# Altium schematic sheet Charging.SchDoc
size A
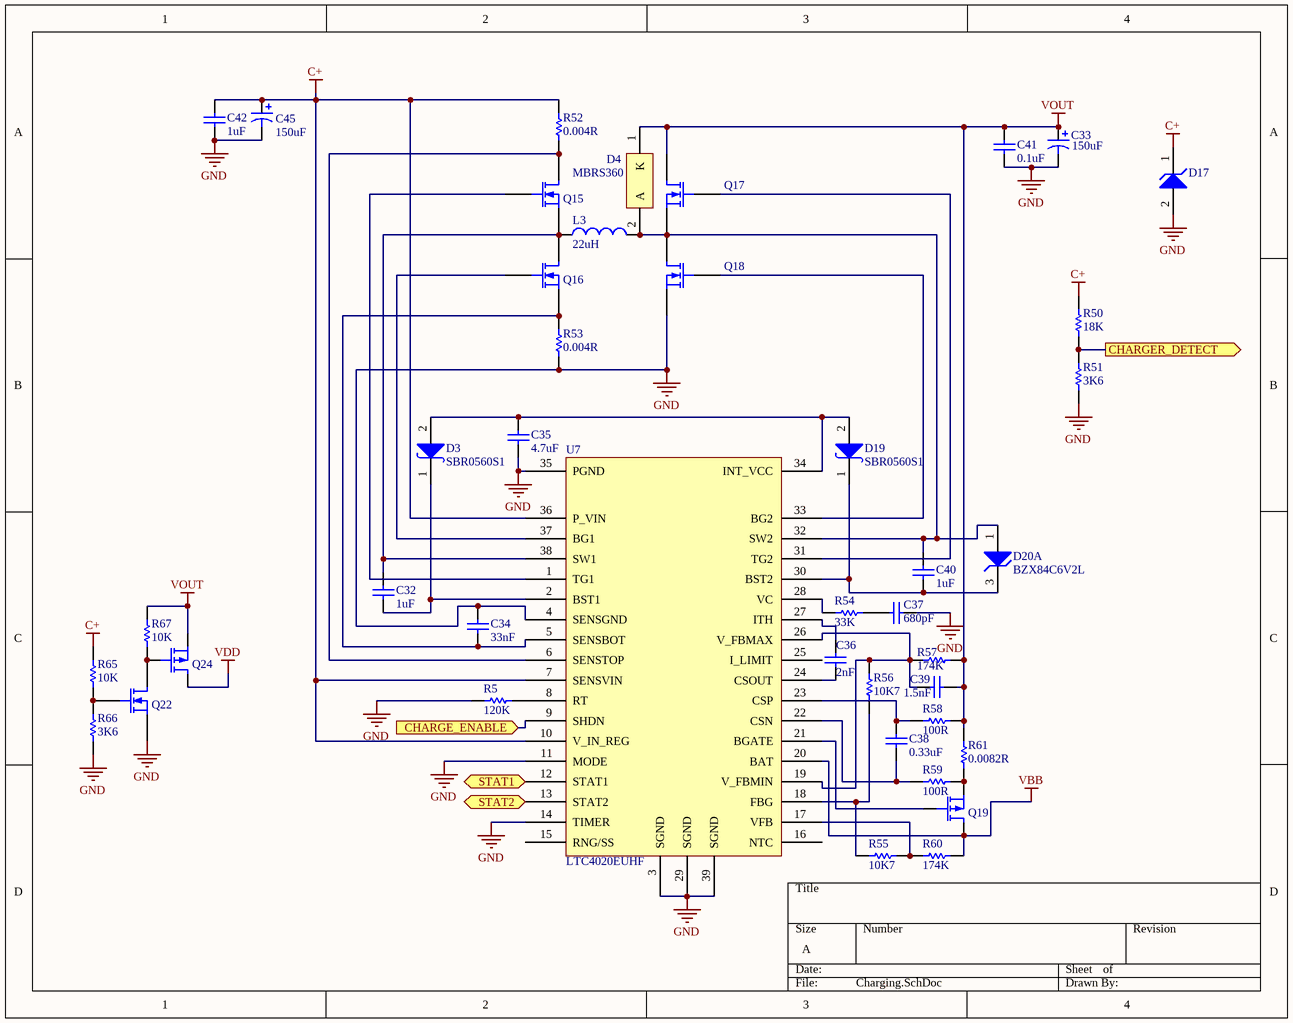
[diagram p0: Charging.SchDoc]

## Parts
C32  1uF  [CAPC0603(1608)100_L]
C33  value 150uF  [CAP 180uF 50V]
C34  33nF  [CAPC0603(1608)100_M]
C35  4.7uF  [CAPC0603(1608)55_L]
C36  2nF  [CAPC0603(1608)100_L]
C37  680pF  [CAPC0603(1608)100_L]
C38  0.33uF  [CAPC0603(1608)100_M]
C39  1.5nF  [CAPC0603(1608)100_N]
C40  1uF  [CAPC0603(1608)100_L]
C41  0.1uF  [CAPC0603(1608)100_L]
C42  1uF  [CAPC0603(1608)100_L]
C45  150uF  [CAP 150uF 25V]
D3  SBR0560S1  [SOD-123]
D4  MBRS360  [ONSC-SMB-2-403A-03_H_V]
D17  (no value)  [ONSC-SOD-123-2-425-04_V]
D19  SBR0560S1  [SOD-123]
D20  BZX84C6V2L  [ONSC-SOT-23-3-318-08_V]  (part A of 2)
L3  22uH  [IHLP-6767GZ]
Q15  MOSFET-N  [SOIC127P600X175-8N]  (value not drawn)
Q16  MOSFET-N  [SOIC127P600X175-8N]  (value not drawn)
Q17  MOSFET-N  [SOIC127P600X175-8N]  (value not drawn)
Q18  MOSFET-N  [SOIC127P600X175-8N]  (value not drawn)
Q19  MOSFET-P  [SOIC127P600X175-8N]  (value not drawn)
Q22  MOSFET-N  [SOT23-3]  (value not drawn)
Q24  MOSFET-P  [SOT23-3]  (value not drawn)
R5  120K  [RESC0603(1608)_L]
R50  18K  [RESC0603(1608)_L]
R51  3K6  [RESC0603(1608)_L]
R52  0.004R  [RESC1206(3216)_L]
R53  0.004R  [RESC1206(3216)_L]
R54  33K  [RESC0603(1608)_N]
R55  10K7  [RESC0603(1608)_M]
R56  10K7  [RESC0603(1608)_M]
R57  174K  [RESC0603(1608)_L]
R58  100R  [RESC0603(1608)_L]
R59  100R  [RESC0603(1608)_L]
R60  174K  [RESC0603(1608)_L]
R61  0.0082R  [RESC2010(5025)_M]
R65  10K  [RESC0603(1608)_N]
R66  3K6  [RESC0603(1608)_N]
R67  10K  [RESC0603(1608)_N]
U7  LTC4020EUHF  [QFN38]

## Ports
CHARGE_ENABLE (in), CHARGER_DETECT (out), STAT1 (out), STAT2 (out)

## Nets
C+: C42.2 C45.1 D17.1(K) R50.2 R52.2 R65.2 U7.7(SENSVIN) U7.10(V_IN_REG) U7.36(P_VIN)
GND: C33.2 C34.2 C35.1 C37.2 C41.1 C42.1 C45.2 D17.2(A) Q18.3(S) Q22.3(S) R5.2 R51.1 R53.1 R66.1 U7.3(SGND) U7.4(SENSGND) U7.11(MODE) U7.14(TIMER) U7.29(SGND) U7.35(PGND) U7.39(SGND)
VBB: Q19.2(D) R60.2 U7.20(BAT)
VDD: Q24.2(D)
VOUT: C33.1 C39.2 C41.2 D4.1(K) Q17.2(D) Q24.3(S) R57.2 R58.2 R61.2 R67.2
CHARGE_ENABLE: U7.9(SHDN) ; port CHARGE_ENABLE
CHARGER_DETECT: R50.1 R51.2 ; port CHARGER_DETECT
STAT1: U7.12(STAT1) ; port STAT1
STAT2: U7.13(STAT2) ; port STAT2
NetC32_1: C32.1 D3.1(K) U7.2(BST1)
NetC32_2: C32.2 L3.1 Q15.3(S) Q16.2(D) U7.38(SW1)
NetC34_1: C34.1 Q16.3(S) R53.2 U7.5(SENSBOT)
NetC35_2: C35.2 D3.2(A) D19.2(A) U7.34(INT_VCC)
NetC36_1: C36.1 U7.24(CSOUT)
NetC36_2: C36.2 U7.27(ITH)
NetC37_1: C37.1 R54.2
NetC38_1: C38.1 R59.1 U7.22(CSN)
NetC38_2: C38.2 R58.1 U7.23(CSP)
NetC39_1: C39.1 R56.2 R57.1 U7.19(V_FBMIN) U7.26(V_FBMAX)
NetC40_1: C40.1 D19.1(K) D20.3(K) U7.30(BST2)
NetC40_2: C40.2 D4.2(A) D20.1(A) L3.2 Q17.3(S) Q18.2(D) U7.32(SW2)
NetQ15_1: Q15.1(G) U7.1(TG1)
NetQ15_2: Q15.2(D) R52.1 U7.6(SENSTOP)
NetQ16_1: Q16.1(G) U7.37(BG1)
NetQ17_1: Q17.1(G) U7.31(TG2)
NetQ18_1: Q18.1(G) U7.33(BG2)
NetQ19_1: Q19.1(G) U7.21(BGATE)
NetQ19_3: Q19.3(S) R59.2 R61.1
NetQ22_1: Q22.1(G) R65.1 R66.2
NetQ22_2: Q22.2(D) Q24.1(G) R67.1
NetR5_1: R5.1 U7.8(RT)
NetR54_1: R54.1 U7.28(VC)
NetR55_1: R55.1 R56.1 U7.18(FBG)
NetR55_2: R55.2 R60.1 U7.17(VFB)

Not connected (* = marked no-connect by the designer): U7 15(RNG/SS) 16(NTC) 25(I_LIMIT)

## Library data of the parts
C32 C40 C42 = CMP-1035-02740-1: CAP 1uF 25V Â±10% 0603 (1608 Metric) Thickness 1mm SMD; Case-Metric: 1608; Case-EIA: 0603; Technology: SMT; Tolerance: Â±10%; Rated Voltage: 25 V; Max Thickness: 1 mm; Value: 1uF
C33 = CAP 180uF 50V: Polarized Capacitor (Axial); Published: 8-Jun-2000; LatestRevisionDate: 17-Jul-2002; LatestRevisionNote: Re-released for DXP Platform.; PackageReference: POLAR0.8; Publisher: Altium Limited; PackageDescription: Polarized Capacitor; 2 Leads
C34 = CMP-1035-02463-1: CAP 33nF 25V Â±5% 0603 (1608 Metric) Thickness 1mm SMD; Case-Metric: 1608; Case-EIA: 0603; Technology: SMT; Value: 33nF; Max Thickness: 1 mm; Rated Voltage: 25 V; Tolerance: Â±5%
C35 = CMP-1035-02779-1: CAP 4.7uF 6.3V Â±10% 0603 (1608 Metric) Thickness 0.55mm SMD; Case-EIA: 0603; Case-Metric: 1608; Technology: SMT; Tolerance: Â±10%; Value: 4.7uF; Max Thickness: 0.55 mm; Rated Voltage: 6.3 V
C36 = CMP-1035-02018-1: CAP 2.2nF 6.3V Â±5% 0603 (1608 Metric) Thickness 1mm SMD; Case-EIA: 0603; Case-Metric: 1608; Tolerance: Â±5%; Value: 2.2nF; Technology: SMT; Max Thickness: 1 mm; Rated Voltage: 6.3 V
C37 = CMP-1035-01762-1: CAP 680pF 6.3V Â±5% 0603 (1608 Metric) Thickness 1mm SMD; Case-EIA: 0603; Case-Metric: 1608; Technology: SMT; Value: 680pF; Max Thickness: 1 mm; Tolerance: Â±5%; Rated Voltage: 6.3 V
C38 = CMP-1035-02679-1: CAP 330nF 50V Â±10% 0603 (1608 Metric) Thickness 1mm SMD; Case-Metric: 1608; Case-EIA: 0603; Max Thickness: 1 mm; Value: 330nF; Rated Voltage: 50 V; Technology: SMT; Tolerance: Â±10%
C39 = CMP-1035-01943-1: CAP 1.5nF 6.3V Â±5% 0603 (1608 Metric) Thickness 1mm SMD; Case-EIA: 0603; Case-Metric: 1608; Value: 1.5nF; Max Thickness: 1 mm; Rated Voltage: 6.3 V; Technology: SMT; Tolerance: Â±5%
C41 = CMP-1035-02591-1: CAP 100nF 50V Â±5% 0603 (1608 Metric) Thickness 1mm SMD; Case-Metric: 1608; Case-EIA: 0603; Rated Voltage: 50 V; Max Thickness: 1 mm; Tolerance: Â±5%; Technology: SMT; Value: 100nF
C45 = CAP 150uF 25V: Polarized Capacitor (Axial); Published: 8-Jun-2000; LatestRevisionDate: 17-Jul-2002; LatestRevisionNote: Re-released for DXP Platform.; PackageReference: POLAR0.8; Publisher: Altium Limited; PackageDescription: Polarized Capacitor; 2 Leads
D4 = CMP-1055-00339-1: Schottky Power Rectifier, 2-Pin SMB, Pb-Free, Tape and Reel; Manufacturer: On Semiconductor; PartNumber: MBRS360BT3G; Configuration: Single; IFSM Max (A): 125; ComponentLink3Description: Package Specification; ComponentLink2Description: Datasheet; DatasheetVersion: Rev. 8; ComponentLink2URL: http://www.onsemi.cn/pub_link/Collateral/MBRS360T3-D.PDF; ComponentLink3URL: http://www.onsemi.com/pub_link/Collateral/1SMB5913BT3-D.PDF; PackageReference: SMB-2-403A-03_H; PackageVersion: Rev. H, 05/2011; ComponentLink1URL: http://www.onsemi.com/; Packing: Tape and Reel; RoHS: TRUE; PackageDescription: 2-Pin Small Molded Package, J-Bend Lead, Body 4.33 x 3.625 mm; Mounting Technology: Surface Mount; ComponentLink1Description: Manufacturer URL
D17 = CMP-1060-00237-1: Zener Voltage Regulator, 500 mW, 2-Pin SOD-123, Pb-Free, Tape and Reel; PartNumber: MMSZ24T1G; Manufacturer: On Semiconductor; P Max (W): 0.5; ComponentLink2URL: http://www.onsemi.com/pub_link/Collateral/MMSZ2V4T1-D.PDF; ComponentLink2Description: Datasheet; RoHS: Pb-Free; Mounting Technology: Surface Mount; ComponentLink1Description: Manufacturer URL; DatasheetVersion: Rev. 11; PackageReference: SOD-123-2-425-04; PackageDescription: 2-Pin SOD, Body 1.6 x 2.69 mm; PackageVersion: Rev. G, 10/2009; ComponentLink1URL: http://www.onsemi.com/; Packing: Tape and Reel; ComponentLink3URL: http://www.onsemi.com/pub_link/Collateral/425-04.PDF; ComponentLink3Description: Package Specification
D20 = CMP-1060-00911-1: Zener Voltage Regulator, 225 mW, 3-Pin SOT-23, Pb-Free, Tape and Reel; Manufacturer: On Semiconductor; PartNumber: BZX84C6V2LT3G; Packing: Tape and Reel; DatasheetVersion: Rev. 17; ComponentLink1Description: Manufacturer URL; Mounting Technology: Surface Mount; ComponentLink2Description: Datasheet; RoHS: Pb-Free; ComponentLink3Description: Package Specification; ComponentLink3URL: http://www.onsemi.cn/pub_link/Collateral/318-08.PDF; PackageVersion: Rev. AP, 11/2009; ComponentLink1URL: http://www.onsemi.com/; PackageDescription: 3-Pin Small Outline Transistor, Body 2.92 x 1.3 mm, Pitch 0.95 mm; ComponentLink2URL: http://www.onsemi.com/pub_link/Collateral/BZX84C2V4LT1-D.PDF; PackageReference: SOT-23-3-318-08
L3 = IHLP6767: Inductor; Code_IEC: 1005; Published: 8-Jun-2000; LatestRevisionDate: 29-May-2009; LatestRevisionNote: IPC-7351 Footprint Added.; PackageReference: 0402-A; Publisher: Altium Limited; PackageDescription: Chip Inductor; Code_JEITA: 0402
Q15-Q18 = MOSFET-N: N-Channel MOSFET; pin to pad: 1>2 2>3 3>1; Published: 8-Jun-2000; LatestRevisionDate: 17-Jul-2002; LatestRevisionNote: Re-released for DXP Platform.; PackageVersion: 1995/1996; PackageReference: E3; Publisher: Altium Limited; PackageDescription: TO, Flat Index; 3 In-Line, Axial Leads; Body Dia. 4.6mm; Lead Dia. 0.5 mm (max)
Q19 = MOSFET-P: P-Channel MOSFET; pin to pad: 1>2 2>3 3>1; Published: 8-Jun-2000; LatestRevisionDate: 17-Jul-2002; LatestRevisionNote: Re-released for DXP Platform.; PackageVersion: 1995/1996; PackageReference: E3; Publisher: Altium Limited; PackageDescription: TO, Flat Index; 3 In-Line, Axial Leads; Body Dia. 4.6mm; Lead Dia. 0.5 mm (max)
Q22 = MOSFET-N: N-Channel MOSFET; Published: 8-Jun-2000; LatestRevisionDate: 17-Jul-2002; LatestRevisionNote: Re-released for DXP Platform.; PackageVersion: 1995/1996; PackageReference: E3; Publisher: Altium Limited; PackageDescription: TO, Flat Index; 3 In-Line, Axial Leads; Body Dia. 4.6mm; Lead Dia. 0.5 mm (max)
Q24 = MOSFET-P: P-Channel MOSFET; Published: 8-Jun-2000; LatestRevisionDate: 17-Jul-2002; LatestRevisionNote: Re-released for DXP Platform.; PackageVersion: 1995/1996; PackageReference: E3; Publisher: Altium Limited; PackageDescription: TO, Flat Index; 3 In-Line, Axial Leads; Body Dia. 4.6mm; Lead Dia. 0.5 mm (max)
R5 = CMP-1012-00124-1: 120K 0.1W 5% 0603 (1608 Metric)  SMD; Value: 120000.00 Ohm; Case-Metric: 1608; Case-EIA: 0603; Power: 0.1 W; Tolerance: 5 %; Technology: SMT
R50 = CMP-1012-00650-1: 18K 0.1W 1% 0603 (1608 Metric)  SMD; Value: 18000.00 Ohm; Case-EIA: 0603; Case-Metric: 1608; Power: 0.1 W; Tolerance: 1 %; Technology: SMT
R51 = CMP-1012-00572-1: 3K6 0.1W 1% 0603 (1608 Metric)  SMD; Case-Metric: 1608; Value: 3600.00 Ohm; Case-EIA: 0603; Tolerance: 1 %; Technology: SMT; Power: 0.1 W
R52 R53 = CMP-1014-00171-1: 1R 0.25W 1% 1206 (3216 Metric)  SMD; Case-EIA: 1206; Value: 1.00 Ohm; Case-Metric: 3216; Technology: SMT; Power: 0.25 W; Tolerance: 1 %
R54 = CMP-1012-00680-1: 33K 0.1W 1% 0603 (1608 Metric)  SMD; Case-EIA: 0603; Value: 33000.00 Ohm; Case-Metric: 1608; Tolerance: 1 %; Power: 0.1 W; Technology: SMT
R55 R56 = CMP-1012-00123-1: 110K 0.1W 5% 0603 (1608 Metric)  SMD; Value: 110000.00 Ohm; Case-Metric: 1608; Case-EIA: 0603; Tolerance: 5 %; Power: 0.1 W; Technology: SMT
R57 R60 = CMP-1012-00152-1: 1M8 0.1W 5% 0603 (1608 Metric)  SMD; Value: 1800000.00 Ohm; Case-Metric: 1608; Case-EIA: 0603; Technology: SMT; Tolerance: 5 %; Power: 0.1 W
R58 R59 = CMP-1012-00050-1: 100R 0.1W 5% 0603 (1608 Metric)  SMD; Case-EIA: 0603; Value: 100.00 Ohm; Case-Metric: 1608; Tolerance: 5 %; Technology: SMT; Power: 0.1 W
R61 = CMP-1017-00171-1: 1R 0.75W 1% 2010 (5025 Metric)  SMD; Value: 1.00 Ohm; Case-Metric: 5025; Case-EIA: 2010; Technology: SMT; Tolerance: 1 %; Power: 0.75 W
R65 R67 = CMP-1012-00098-1: 10K 0.1W 5% 0603 (1608 Metric)  SMD; Case-EIA: 0603; Value: 10000.00 Ohm; Case-Metric: 1608; Technology: SMT; Tolerance: 5 %; Power: 0.1 W
R66 = CMP-1012-00087-1: 3K6 0.1W 5% 0603 (1608 Metric)  SMD; Case-EIA: 0603; Case-Metric: 1608; Value: 3600.00 Ohm; Technology: SMT; Power: 0.1 W; Tolerance: 5 %